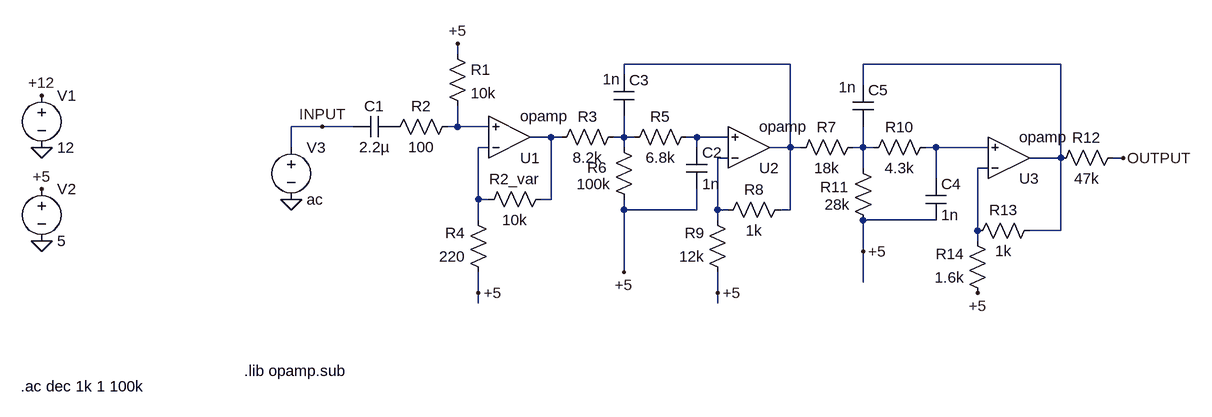
[diagram p0: schematic Simulacion.asc]
Simulacion.asc, the LTspice schematic file:
Version 4
SHEET 1 1380 680
WIRE -48 0 -48 -16
WIRE 464 16 208 16
WIRE 880 16 576 16
WIRE 208 32 208 16
WIRE 576 48 576 16
WIRE -256 112 -304 112
WIRE -208 112 -256 112
WIRE -48 112 -48 80
WIRE -48 112 -64 112
WIRE 0 112 -48 112
WIRE 96 128 64 128
WIRE 112 128 96 128
WIRE 208 128 208 96
WIRE 208 128 192 128
WIRE 224 128 208 128
WIRE 320 128 304 128
WIRE 368 128 320 128
WIRE -304 144 -304 112
WIRE 0 144 -16 144
WIRE 208 144 208 128
WIRE 320 144 320 128
WIRE 464 144 464 16
WIRE 464 144 432 144
WIRE 480 144 464 144
WIRE 576 144 576 112
WIRE 576 144 560 144
WIRE 592 144 576 144
WIRE 688 144 672 144
WIRE 768 144 688 144
WIRE 368 160 352 160
WIRE 880 160 880 16
WIRE 880 160 832 160
WIRE 976 160 960 160
WIRE 576 176 576 144
WIRE 768 176 752 176
WIRE 688 192 688 144
WIRE -16 224 -16 144
WIRE 0 224 -16 224
WIRE 96 224 96 128
WIRE 96 224 80 224
WIRE 208 240 208 224
WIRE 320 240 320 208
WIRE 320 240 208 240
WIRE 352 240 352 160
WIRE 368 240 352 240
WIRE 464 240 464 144
WIRE 464 240 448 240
WIRE -16 256 -16 224
WIRE 352 256 352 240
WIRE 688 256 576 256
WIRE 752 272 752 176
WIRE 880 272 880 160
WIRE 880 272 832 272
WIRE 752 288 752 272
WIRE 576 304 576 256
WIRE 208 336 208 240
WIRE 576 352 576 304
WIRE -16 368 -16 336
WIRE 352 368 352 336
WIRE -16 384 -16 368
WIRE 352 384 352 368
FLAG -688 288 0
FLAG -688 144 0
FLAG -688 64 +12
FLAG -688 208 +5
FLAG 976 160 OUTPUT
FLAG 752 368 +5
FLAG 576 304 +5
FLAG 352 368 +5
FLAG 208 336 +5
FLAG -48 -16 +5
FLAG -16 368 +5
FLAG -256 112 INPUT
FLAG -304 224 0
SYMBOL Opamps\\opamp 32 192 M180
SYMATTR InstName U1
SYMBOL Opamps\\opamp 400 208 M180
SYMATTR InstName U2
SYMBOL res -64 -16 R0
SYMATTR InstName R1
SYMATTR Value 10k
SYMBOL res -16 240 R270
WINDOW 0 32 56 VTop 2
WINDOW 3 0 56 VBottom 2
SYMATTR InstName R2_var
SYMATTR Value 10k
SYMBOL res 96 144 R270
WINDOW 0 32 56 VTop 2
WINDOW 3 0 56 VBottom 2
SYMATTR InstName R3
SYMATTR Value 8.2k
SYMBOL res 0 352 R180
WINDOW 0 36 76 Left 2
WINDOW 3 36 40 Left 2
SYMATTR InstName R4
SYMATTR Value 220
SYMBOL cap -144 96 R90
WINDOW 0 0 32 VBottom 2
WINDOW 3 32 32 VTop 2
SYMATTR InstName C1
SYMATTR Value 2.2µ
SYMBOL res 320 112 R90
WINDOW 0 0 56 VBottom 2
WINDOW 3 32 56 VTop 2
SYMATTR InstName R5
SYMATTR Value 6.8k
SYMBOL res 224 240 R180
WINDOW 0 42 65 Left 2
WINDOW 3 36 40 Left 2
SYMATTR InstName R6
SYMATTR Value 100k
SYMBOL cap 304 144 R0
SYMATTR InstName C2
SYMATTR Value 1n
SYMBOL cap 192 32 R0
WINDOW 3 -17 7 Left 2
SYMATTR Value 1n
SYMATTR InstName C3
SYMBOL res 464 160 R270
WINDOW 0 32 56 VTop 2
WINDOW 3 0 56 VBottom 2
SYMATTR InstName R7
SYMATTR Value 18k
SYMBOL res 352 256 R270
WINDOW 0 32 56 VTop 2
WINDOW 3 0 56 VBottom 2
SYMATTR InstName R8
SYMATTR Value 1k
SYMBOL res 368 352 R180
WINDOW 0 36 76 Left 2
WINDOW 3 36 40 Left 2
SYMATTR InstName R9
SYMATTR Value 12k
SYMBOL Opamps\\opamp 800 224 M180
SYMATTR InstName U3
SYMBOL res 688 128 R90
WINDOW 0 0 56 VBottom 2
WINDOW 3 32 56 VTop 2
SYMATTR InstName R10
SYMATTR Value 4.3k
SYMBOL res 592 272 R180
WINDOW 0 38 67 Left 2
WINDOW 3 36 40 Left 2
SYMATTR InstName R11
SYMATTR Value 28k
SYMBOL cap 672 192 R0
SYMATTR InstName C4
SYMATTR Value 1n
SYMBOL cap 560 48 R0
WINDOW 3 -22 3 Left 2
SYMATTR Value 1n
SYMATTR InstName C5
SYMBOL res 864 176 R270
WINDOW 0 32 56 VTop 2
WINDOW 3 0 56 VBottom 2
SYMATTR InstName R12
SYMATTR Value 47k
SYMBOL res 736 288 R270
WINDOW 0 32 56 VTop 2
WINDOW 3 0 56 VBottom 2
SYMATTR InstName R13
SYMATTR Value 1k
SYMBOL res 768 384 R180
WINDOW 0 36 76 Left 2
WINDOW 3 36 40 Left 2
SYMATTR InstName R14
SYMATTR Value 1.6k
SYMBOL voltage -688 48 R0
WINDOW 123 0 0 Left 2
WINDOW 39 0 0 Left 2
SYMATTR InstName V1
SYMATTR Value 12
SYMBOL voltage -688 192 R0
WINDOW 123 0 0 Left 2
WINDOW 39 0 0 Left 2
SYMATTR InstName V2
SYMATTR Value 5
SYMBOL voltage -304 128 R0
WINDOW 123 0 0 Left 2
WINDOW 39 0 0 Left 2
SYMATTR InstName V3
SYMATTR Value ac
SYMBOL res -160 128 R270
WINDOW 0 32 56 VTop 2
WINDOW 3 0 56 VBottom 2
SYMATTR InstName R2
SYMATTR Value 100
TEXT -376 488 Left 2 !.lib opamp.sub
TEXT -720 512 Left 2 !.ac dec 1k 1 100k

The netlist it stands for:
* Simulacion.asc
XU1 N007 N003 N004 opamp Aol=100K GBW=10Meg  ; pins invin noninvin out
XU2 N010 N006 N001 opamp Aol=100K GBW=10Meg  ; pins invin noninvin out
R1 +5 N003 10k
R2_var N007 N004 10k
R3 N004 N005 8.2k
R4 +5 N007 220
C1 P001 INPUT 2.2µ
R5 N006 N005 6.8k
R6 +5 N005 100k
C2 N006 +5 1n
C3 N001 N005 1n
R7 N001 N008 18k
R8 N010 N001 1k
R9 +5 N010 12k
XU3 N011 N009 N002 opamp Aol=100K GBW=10Meg  ; pins invin noninvin out
R10 N009 N008 4.3k
R11 +5 N008 28k
C4 N009 +5 1n
C5 N002 N008 1n
R12 N002 OUTPUT 47k
R13 N011 N002 1k
R14 +5 N011 1.6k
V1 +12 0 12
V2 +5 0 5
V3 INPUT 0 ac
R2 P001 N003 100
.lib opamp.sub
.ac dec 1k 1 100k
.backanno
.end